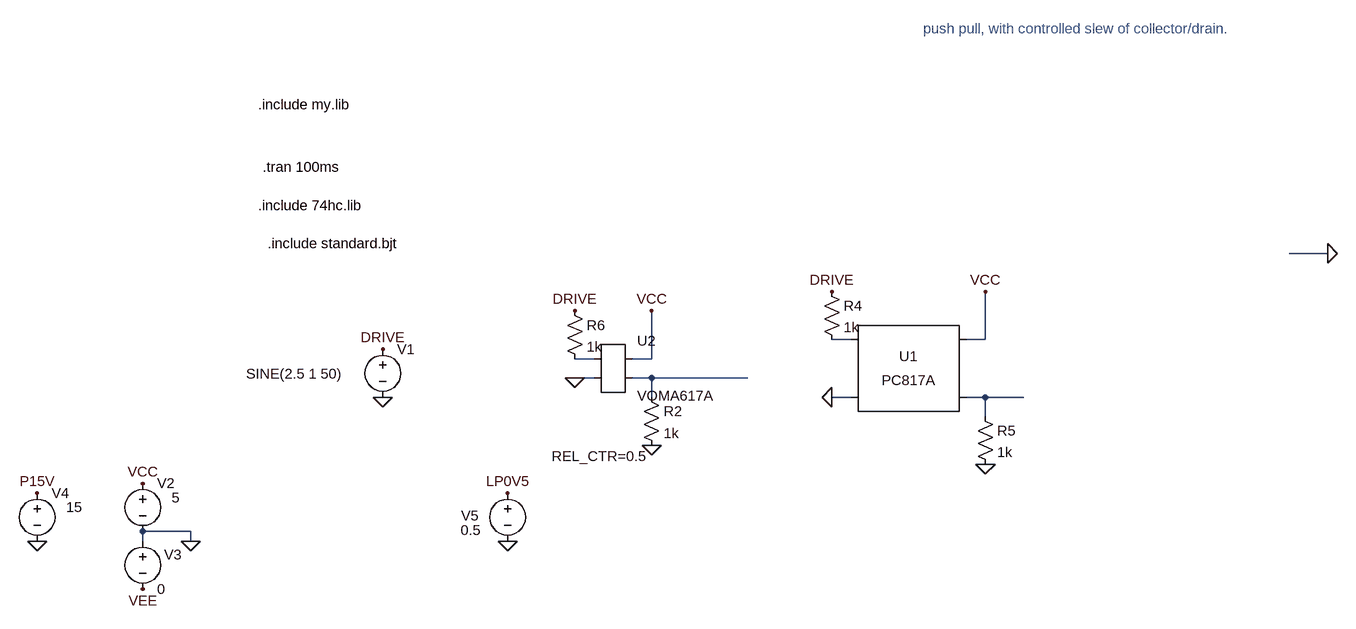
[diagram p0: schematic Draft86.asc]
Draft86.asc, the LTspice schematic file:
Version 4
SHEET 1 6648 1268
WIRE 3280 -80 3216 -80
WIRE 944 64 912 64
WIRE 1168 64 1168 -16
WIRE 1168 64 1136 64
WIRE 464 96 432 96
WIRE 560 96 560 16
WIRE 560 96 528 96
WIRE 432 128 416 128
WIRE 464 128 432 128
WIRE 560 128 528 128
WIRE 720 128 560 128
WIRE 560 160 560 128
WIRE 944 160 912 160
WIRE 1168 160 1136 160
WIRE 1232 160 1168 160
WIRE 1168 192 1168 160
WIRE -208 384 -288 384
WIRE -288 400 -288 384
WIRE -208 400 -208 384
FLAG -208 400 0
FLAG -288 304 VCC
FLAG -288 480 VEE
FLAG -464 400 0
FLAG -464 320 P15V
FLAG 112 160 0
FLAG 320 400 0
FLAG 320 320 LP0V5
FLAG 112 80 DRIVE
FLAG 3280 -80 0
FLAG 560 16 VCC
FLAG 560 240 0
FLAG 432 128 0
FLAG 912 -16 DRIVE
FLAG 912 160 0
FLAG 1168 -16 VCC
FLAG 1168 272 0
FLAG 432 16 DRIVE
SYMBOL voltage -288 288 R0
WINDOW 123 0 0 Left 0
WINDOW 39 0 0 Left 0
WINDOW 3 48 40 Left 2
SYMATTR Value 5
SYMATTR InstName V2
SYMBOL voltage -288 384 R0
WINDOW 123 0 0 Left 0
WINDOW 39 0 0 Left 0
WINDOW 0 36 39 Left 2
SYMATTR InstName V3
SYMATTR Value 0
SYMBOL voltage -464 304 R0
WINDOW 123 0 0 Left 0
WINDOW 39 0 0 Left 0
WINDOW 3 48 40 Left 2
SYMATTR Value 15
SYMATTR InstName V4
SYMBOL voltage 112 64 R0
WINDOW 123 0 0 Left 0
WINDOW 39 0 0 Left 0
WINDOW 3 -228 57 Left 2
SYMATTR Value SINE(2.5 1 50)
SYMATTR InstName V1
SYMBOL voltage 320 304 R0
WINDOW 123 0 0 Left 0
WINDOW 39 0 0 Left 0
WINDOW 3 -78 78 Left 2
WINDOW 0 -77 54 Left 2
SYMATTR Value 0.5
SYMATTR InstName V5
SYMBOL AutoGenerated\\VOMA617A 496 112 R0
WINDOW 39 -24 131 Top 2
SYMATTR InstName U2
SYMATTR SpiceLine REL_CTR=0.5
SYMBOL res 544 144 R0
SYMATTR InstName R2
SYMATTR Value 1k
SYMBOL res 416 0 R0
SYMATTR InstName R6
SYMATTR Value 1k
SYMBOL Optos\\PC817A 1040 112 R0
SYMATTR InstName U1
SYMBOL res 896 -32 R0
SYMATTR InstName R4
SYMATTR Value 1k
SYMBOL res 1152 176 R0
SYMATTR InstName R5
SYMATTR Value 1k
TEXT -88 -224 Left 2 !.tran 100ms
TEXT -96 -160 Left 2 !.include 74hc.lib
TEXT -80 -96 Left 2 !.include standard.bjt
TEXT 1064 -480 Left 2 ;push pull, with controlled slew of collector/drain.
TEXT -96 -328 Left 2 !.include my.lib

The netlist it stands for:
* Draft86.asc
V2 VCC 0 5
V3 0 VEE 0
V4 P15V 0 15
V1 DRIVE 0 SINE(2.5 1 50)
V5 LP0V5 0 0.5
* U2: VOMA617A REL_CTR=0.5 (symbol AutoGenerated\VOMA617A not available, pins judged from their places): pin1=N002 pin2=0 pin3=VCC pin4=N003
R2 N003 0 1k
R6 DRIVE N002 1k
XU1 N001 0 VCC N004 PC817 Igain=1m
R4 DRIVE N001 1k
R5 N004 0 1k
.tran 100ms
.include 74hc.lib
.include standard.bjt
* push pull, with controlled slew of collector/drain.
.include my.lib
.lib PC817.sub
.backanno
.end